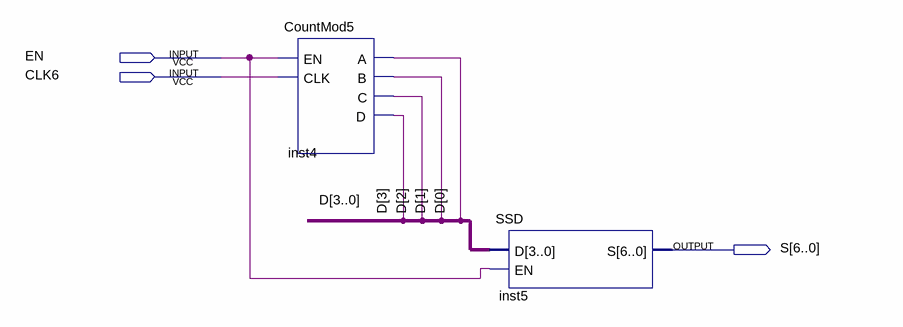
[diagram p0: schematic sheet]
// Quartus schematic Message.bdf as structural Verilog: 2 symbols, 3 pins
module Message (
  input  EN,
  input  CLK6,
  output [6:0] S
);

  wire [3:0] D;

  CountMod5 inst4 (.EN(EN), .CLK(CLK6), .A(D[0]), .B(D[1]), .C(D[2]), .D(D[3]));
  SSD inst5 (.D(D), .EN(EN), .S(S));
endmodule
